# Altium schematic sheet ZYNQ_reset.SchDoc
size A4
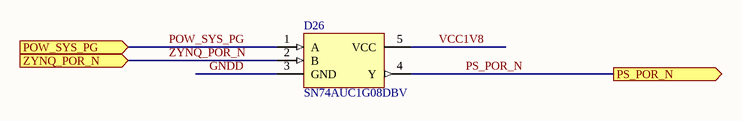
[diagram p0: ZYNQ_reset.SchDoc]

## Parts
D26  SN74AUC1G08DBV  [SOT-23-5]

## Ports
POW_SYS_PG (in), PS_POR_N (out), ZYNQ_POR_N (in)

## Nets
GNDD: D26.3(GND)
POW_SYS_PG: D26.1(A) ; port POW_SYS_PG
PS_POR_N: D26.4(Y) ; port PS_POR_N
VCC1V8: D26.5(VCC)
ZYNQ_POR_N: D26.2(B) ; port ZYNQ_POR_N